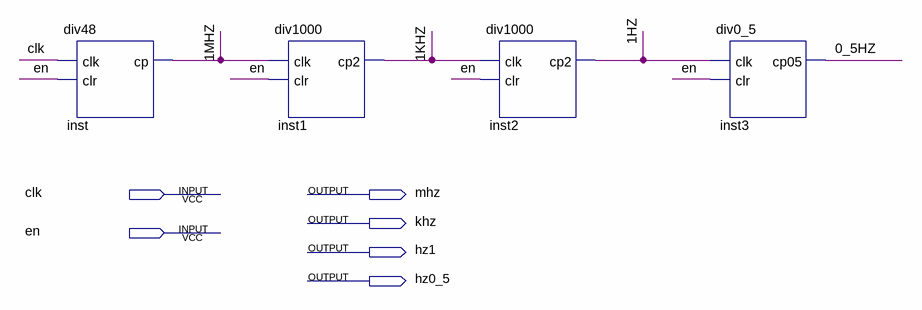
[diagram p0: schematic sheet]
// Quartus schematic fenpin.bdf as structural Verilog: 4 symbols, 6 pins
module fenpin (
  input  clk,
  input  en,
  output mhz,
  output khz,
  output hz1,
  output hz0_5
);

  wire \0_5HZ , \1HZ , \1KHZ , \1MHZ ;

  div48 inst (.clk(clk), .clr(en), .cp(\1MHZ ));
  div1000 inst1 (.clk(\1MHZ ), .clr(en), .cp2(\1KHZ ));
  div1000 inst2 (.clk(\1KHZ ), .clr(en), .cp2(\1HZ ));
  div0_5 inst3 (.clk(\1HZ ), .clr(en), .cp05(\0_5HZ ));
endmodule
